# EAGLE design transistor-test (EAGLE 9.2.2)
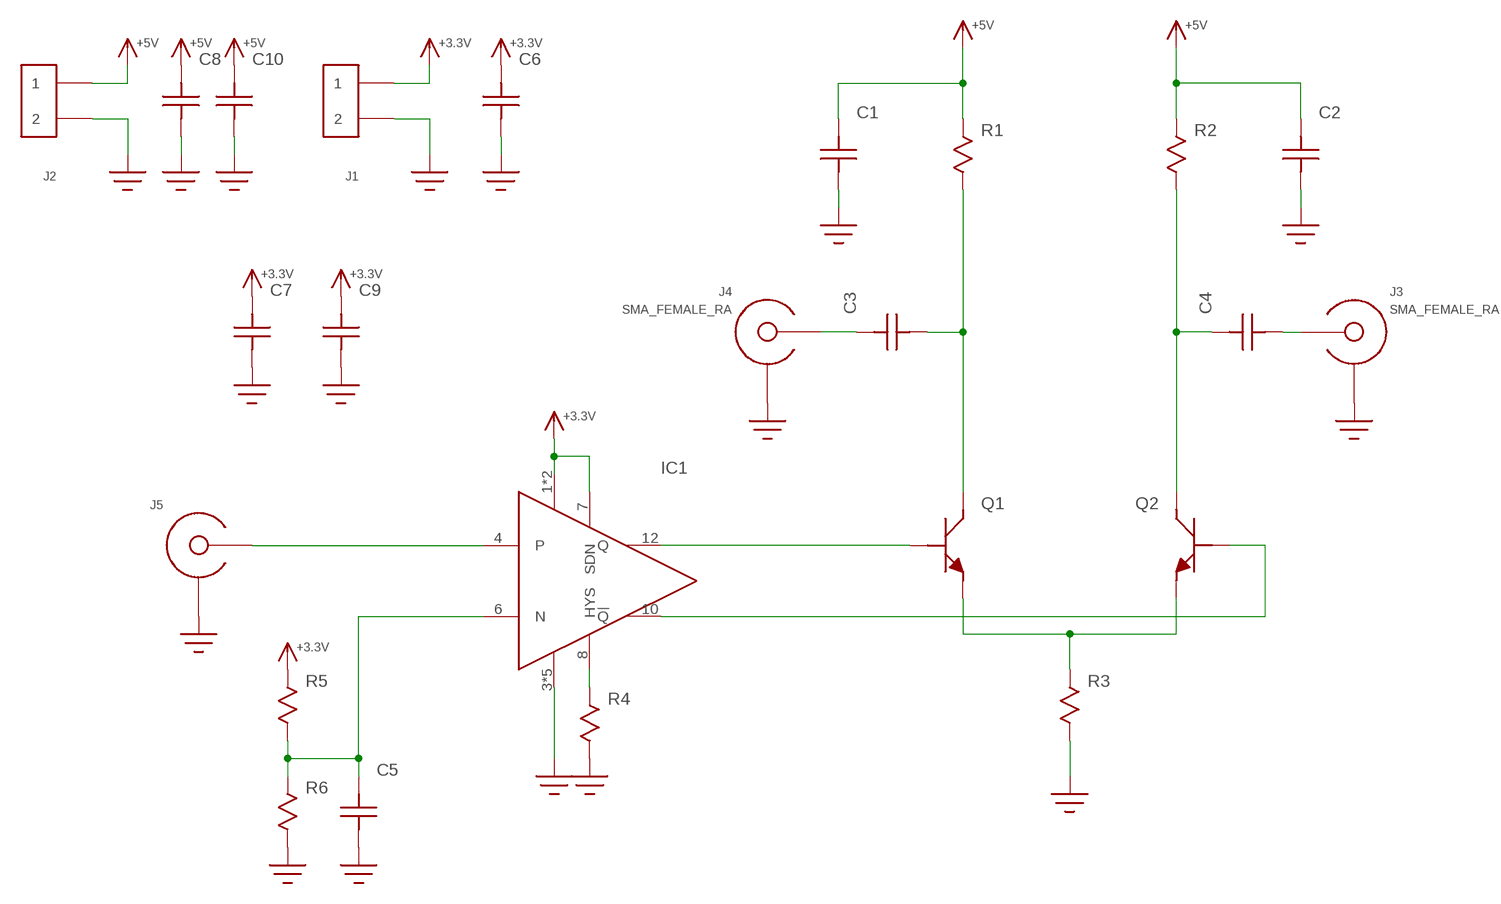
[diagram p0: schematic, sheet 1]

## Parts
C1  C0603  [C0603]
C2  C0603  [C0603]
C3  C0603  [C0603]
C4  C0603  [C0603]
C5  C0603  [C0603]
C6  C1206  [1206]
C7  C0603  [C0603]
C8  C1206  [1206]
C9  C0603  [C0603]
C10  C1206  [1206]
IC1  ADCMP607  [QFN12-3X3]
J1  HEADER_2PIN  [HEADER_2PIN]
J2  HEADER_2PIN  [HEADER_2PIN]
J3  SMA_FEMALE_RA  [SMA_RA_PCB]
J4  SMA_FEMALE_RA  [SMA_RA_PCB]
J5  SMA_END_LAUNCH2L  [SMA_EDGE_LAUNCH_2L]
Q1  MMBTH10  [SOT-23]
Q2  MMBTH10  [SOT-23]
R1  R0603  [R0603]
R2  R0603  [R0603]
R3  R0603  [R0603]
R4  R0603  [R0603]
R5  R0603  [R0603]
R6  R0603  [R0603]

## Nets
+3.3V: C6.P$2 C7.P$2 C9.P$2 IC1.1(VCC) IC1.2(VCC) IC1.7(SDN) J1.1 R5.P$1
+5V: C1.P$2 C2.P$2 C8.P$2 C10.P$2 J2.1 R1.P$1 R2.P$1
GND: C1.P$1 C2.P$1 C5.P$1 C6.P$1 C7.P$1 C8.P$1 C9.P$1 C10.P$1 IC1.3(VEE) IC1.5(VEE) IC1.9(VEE) IC1.11(VEE) IC1.EP(VEE) J1.2 J2.2 J3.SHIELD@1(SHIELD) J3.SHIELD@2(SHIELD) J3.SHIELD@3(SHIELD) J3.SHIELD@4(SHIELD) J4.SHIELD@1(SHIELD) J4.SHIELD@2(SHIELD) J4.SHIELD@3(SHIELD) J4.SHIELD@4(SHIELD) J5.BOTTOM_GND(SHIELD) J5.GND@1(SHIELD) J5.GND@2(SHIELD) J5.GND@3(SHIELD) J5.GND@4(SHIELD) J5.GND@5(SHIELD) J5.GND@6(SHIELD) J5.GND@7(SHIELD) J5.GND@8(SHIELD) J5.GND@11(SHIELD) J5.GND@12(SHIELD) J5.GND@14(SHIELD) J5.GND@15(SHIELD) J5.GND@16(SHIELD) J5.GND@17(SHIELD) J5.GND_PAD1(SHIELD) J5.GND_PAD2(SHIELD) R3.P$2 R4.P$2 R6.P$2
N$1: C3.P$1 Q1.3(C) R1.P$2
N$2: C4.P$2 Q2.3(C) R2.P$2
N$3: Q1.2(E) Q2.2(E) R3.P$1
N$4: IC1.12(Q) Q1.1(B)
N$5: IC1.10(!Q!) Q2.1(B)
N$6: C3.P$2 J4.CENTER
N$7: C4.P$1 J3.CENTER
N$8: C5.P$2 IC1.6(N) R5.P$2 R6.P$1
N$9: IC1.8(HYS) R4.P$1
N$10: IC1.4(P) J5.CENTER@1(CENTER)

## Library data of the parts
C1-C10 = yapo:C
IC1 = yapo:ADCMP607
J1 J2 = yapo:HEADER_2PIN
J3 J4 = yapo:SMA_FEMALE_RA
J5 = yapo:SMA_END_LAUNCH
Q1 Q2 = yapo:MMBTH10
R1-R6 = yapo:R

## Net classes
1 50-ohm: width 0.356 mm, clearance 0.508 mm

## Board
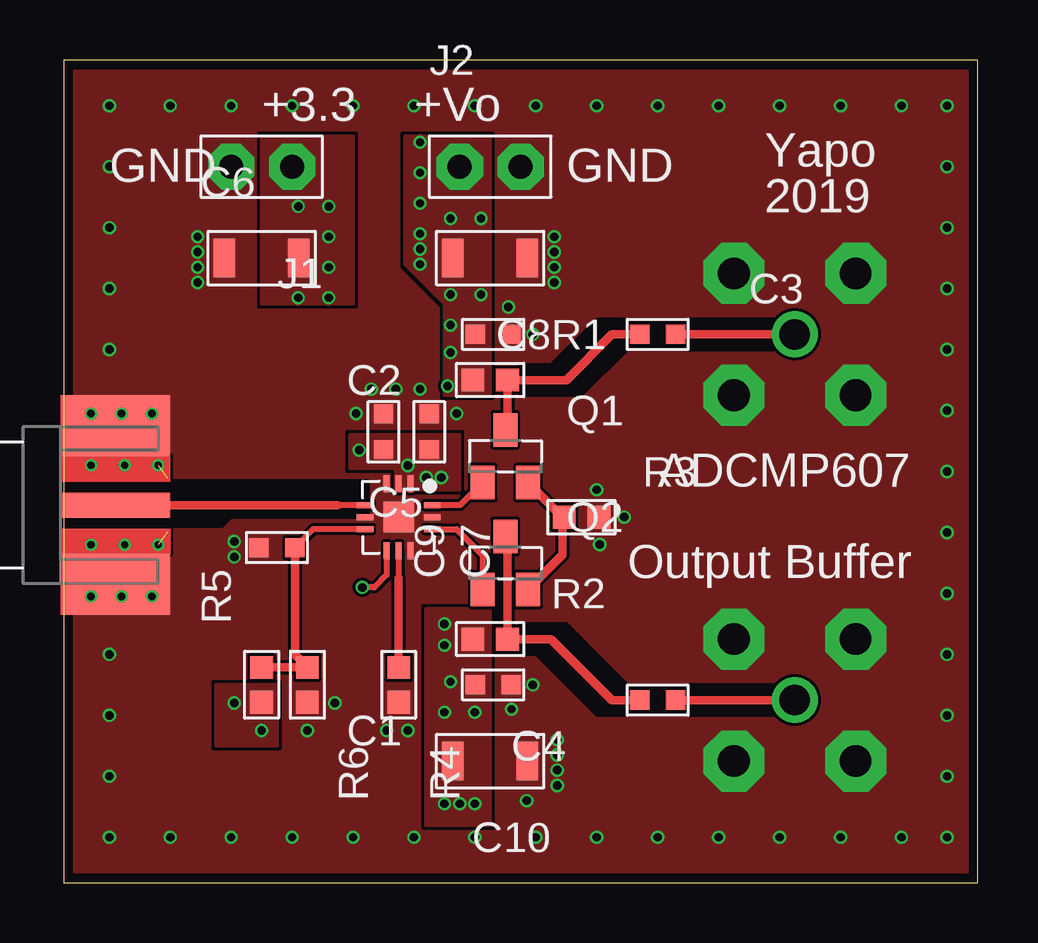
[diagram p1: board, top side]
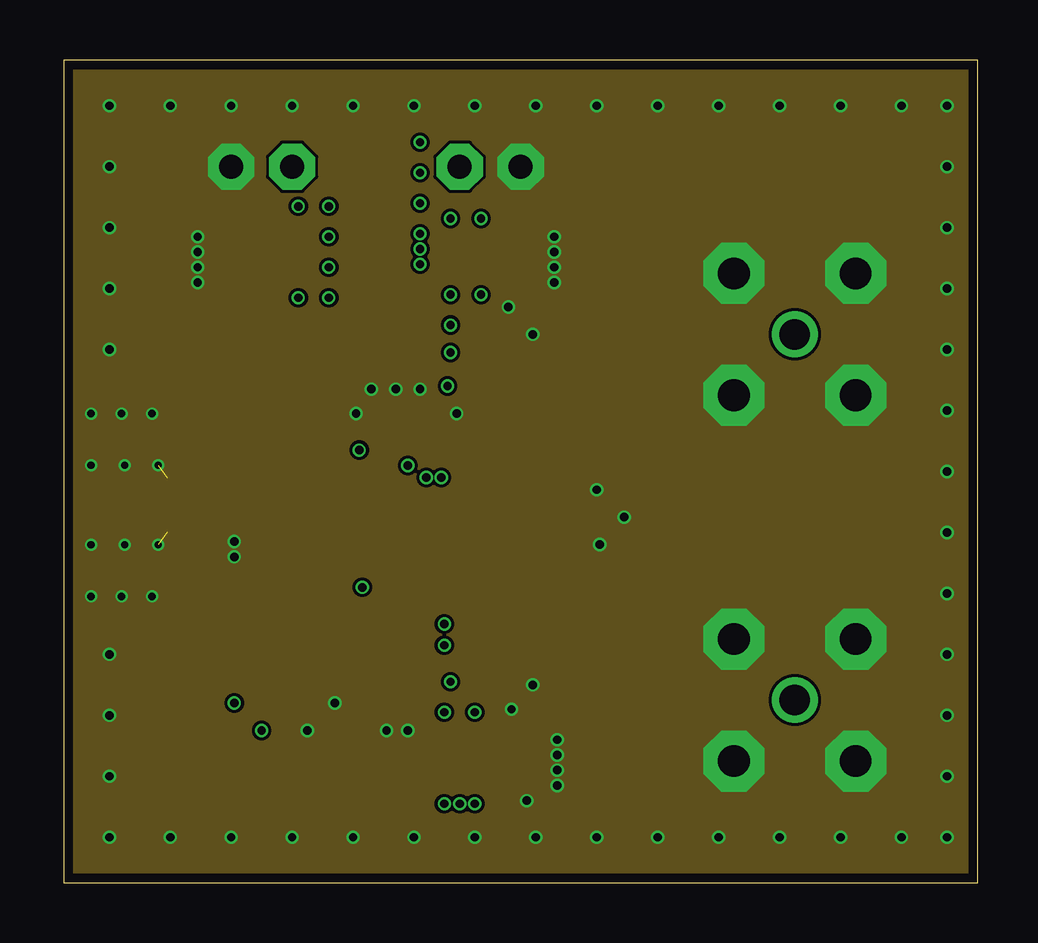
[diagram p2: board, inner layer Route2]
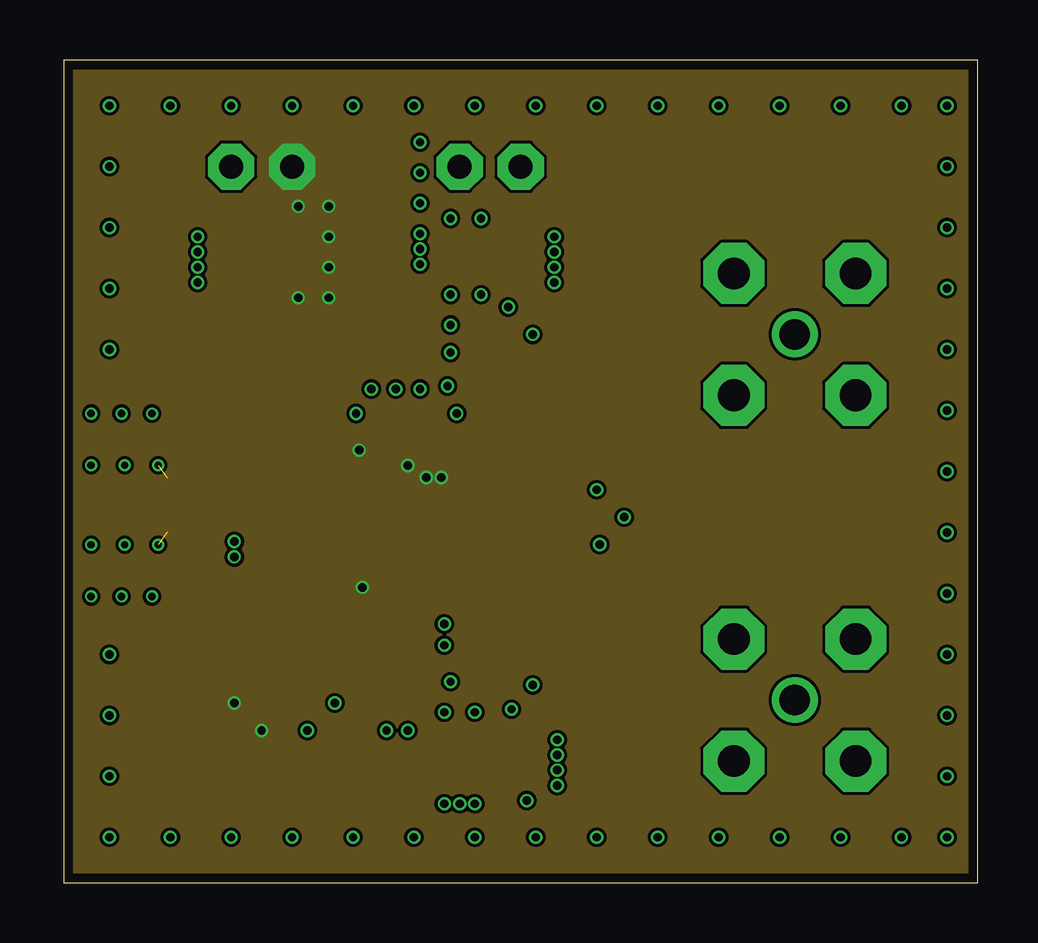
[diagram p3: board, inner layer Route15]
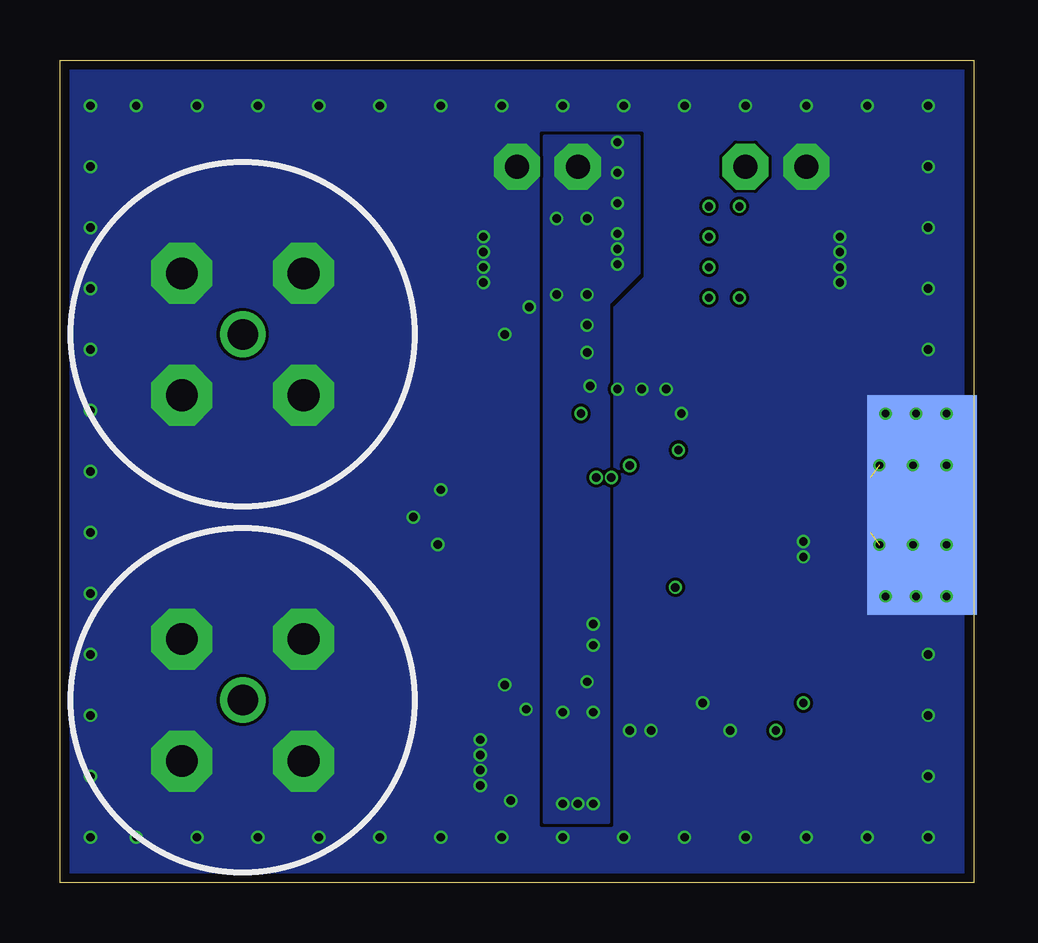
[diagram p4: board, bottom side, seen from below]

Size 38.1 x 34.29 mm. Coordinates in mm from the lower left corner, seen from the top.
Outline: 0,0 38.1,0 38.1,34.29 0,34.29 0,0
Copper layers (1*2*15*16): Top 0.035559375mm / dielectric 0.17018125mm / Route2 0.01778125mm / dielectric 47mil / Route15 0.01778125mm / dielectric 0.17018125mm / Bottom 0.035559375mm
Design rules "oshpark-4layer *": minimum track width 5mil, minimum drill 10mil, track to track 5mil, track to pad 5mil, pad to pad 5mil, via to via 5mil, smd to smd 5mil, copper to edge 15mil, drill to drill 6mil, minimum pad ring 4mil, minimum via ring 4mil, stop-mask expansion 2.5mil, vias tented up to drill 20mil, thermal gap 10mil
tRestrict: area 4.4,14.9 to 12.7,16.8; area 19.1,7 to 24.8,10.8; area 24.8,7 to 29.8,8.3; area 24.8,22.2 to 30.5,23.5; area 19.1,20.3 to 24.8,23.5

### Footprints (pad centres in the part's own frame; a part is rotated, then mirrored left to right if it is on the bottom)
C0603 = smd 0.8 x 0.8: P$1 -0.75,0; P$2 0.75,0
1206 = smd 0.9 x 1.6: P$1 -1.55,0; P$2 1.55,0
QFN12-3X3 = smd 0.7 x 0.25: 1 -1.4,0.5; 2 -1.4,0; 3 -1.4,-0.5; 7 1.4,-0.5; 8 1.4,0; 9 1.4,0.5 | smd 0.25 x 0.7: 4 -0.5,-1.4; 5 0,-1.4; 6 0.5,-1.4; 10 0.5,1.4; 11 0,1.4; 12 -0.5,1.4 | smd 1.27 x 1.27: EP 0,0
HEADER_2PIN = drill 1 pad 1.93 octagon: 1 -1.27,0; 2 1.27,0
SMA_RA_PCB = drill 1.27 pad 1.778: CENTER 0,0 | drill 1.321 pad 2.54 octagon: SHIELD@1 -2.54,-2.54; SHIELD@2 -2.54,2.54; SHIELD@3 2.54,2.54; SHIELD@4 2.54,-2.54
SMA_EDGE_LAUNCH_2L = smd 4.572 x 9.144 bottom: BOTTOM_GND 2.286,0 | smd 4.572 x 1.041: CENTER@1 2.286,0 | drill 0.3: GND@1 1.27,3.81; GND@2 3.81,3.81; GND@3 1.27,1.651; GND@4 4.064,1.651; GND@5 1.27,-1.651; GND@6 4.064,-1.651; GND@7 1.27,-3.81; GND@8 3.81,-3.81; GND@14 2.54,3.81; GND@15 2.54,-3.81; GND@16 2.667,-1.651; GND@17 2.667,1.651 | smd 0.051 x 0.051: GND@11 4.445,1.143; GND@12 4.445,-1.143 | smd 4.572 x 2.54: GND_PAD1 2.286,3.302; GND_PAD2 2.286,-3.302
SOT-23 = smd 1 x 1.4: 1 -0.95,-1.1; 2 0.95,-1.1; 3 0,1.1
R0603 = smd 0.95 x 0.95: P$1 -0.725,0; P$2 0.725,0

### Placement (x,y rotation side)
C1  17.91,8.26 180 top
C2  17.91,22.86 180 top
C3  24.77,22.86 0 top
C4  24.77,7.62 180 top
C5  8.89,13.97 0 top
C6  8.26,26.04 0 top
C7  15.24,18.8 270 top
C8  17.78,26.04 180 top
C9  13.34,18.8 270 top
C10  17.78,5.08 180 top
IC1  13.97,15.24 270 top
J1  8.26,29.84 180 top
J2  17.78,29.84 0 top
J3  30.48,7.62 0 top
J4  30.48,22.86 0 top
J5  -0.13,15.75 0 top
Q1  18.41,17.78 0 top
Q2  18.41,13.34 0 top
R1  17.78,20.95 0 top
R2  17.78,10.16 0 top
R3  21.59,15.24 0 top
R4  13.97,8.26 270 top
R5  8.26,8.26 90 top
R6  10.16,8.26 270 top

### Tracks (layer width: path | path; a pad name or v marks a point on that pad's centre or on a via)
+3.3V  (via drill 0.35)
  Top 0.254: IC1.7 13.47,12.84 12.95,12.32 v12.45,12.32
  other vias: 15.11,16.89 15.75,16.89 12.32,18.03 14.35,17.4 7.11,7.49 8.26,6.35 9.78,28.19 11.05,26.92 11.05,25.65 9.78,24.38 11.05,24.38 11.05,28.19
  pour Route15 (no thermals): 0,0 38.1,0 38.1,34.29 0,34.29
  pour Top (no thermals): 13.84,16.38 13.84,17.27 11.94,17.27 11.94,18.67 16.51,18.67 16.51,16.38
  pour Top (no thermals): 6.99,8.26 8.89,8.26 8.89,5.71 6.35,5.71 6.35,8.26
  pour Top (no thermals): 8.26,31.11 8.26,24.13 12.06,24.13 12.06,31.11
+5V  (via drill 0.35)
  other vias: 16,20.7 16.13,22.1 16.13,23.24 15.88,10.79 15.88,9.91 16.13,8.38 17.14,7.11 16.13,27.69 17.4,27.69 14.86,27.05 14.86,26.42 14.86,25.78 14.86,30.86 14.86,29.59 14.86,28.32 16.13,24.51 17.4,24.51 15.88,7.11 15.88,3.3 17.14,3.3 16.51,3.3
  pour Top (no thermals): 15.88,24.13 17.78,24.13 17.78,20.32 15.88,20.32
  pour Top (no thermals): 15.11,11.43 17.78,11.43 17.78,2.41 15.11,2.41
  pour Top (no thermals): 15.24,31.11 15.24,24.77 15.88,24.13 17.78,24.13 17.78,31.11
  pour Top (no thermals): 15.24,31.11 15.24,24.77 15.88,24.13 17.78,24.13 17.78,31.11
  pour Top (no thermals): 14.22,31.11 14.22,25.78 15.88,24.13 17.78,24.13 17.78,31.11
  pour Bottom (no thermals): 13.97,31.11 13.97,25.4 15.24,24.13 15.24,2.54 17.91,2.54 17.91,31.11
GND  (via drill 0.35)  (2 unrouted)
  other vias: 13.84,20.57 14.86,20.57 23.37,15.24 12.83,20.57 12.19,19.56 16.38,19.56 7.11,14.22 7.11,13.59 11.3,7.49 10.16,6.35 13.46,6.35 14.35,6.35 19.56,8.26 18.67,7.24 18.54,24 19.56,22.86 22.23,16.38 22.35,14.1 5.59,26.92 5.59,26.29 5.59,25.65 5.59,25.02 20.45,26.92 20.45,26.29 20.45,25.65 20.45,25.02 1.91,1.91 4.45,1.91 6.99,1.91 9.53,1.91 12.06,1.91 14.61,1.91 17.14,1.91 19.68,1.91 22.23,1.91 24.77,1.91 1.91,32.38 4.45,32.38 6.99,32.38 9.53,32.38 12.06,32.38 14.61,32.38 17.14,32.38 19.68,32.38 22.23,32.38 24.77,32.38 27.3,32.38 29.84,32.38 32.38,32.38 34.92,32.38 27.3,1.91 29.84,1.91 32.38,1.91 34.92,1.91 36.83,1.91 36.83,4.45 36.83,6.99 36.83,9.53 36.83,12.06 36.83,14.61 36.83,17.14 36.83,19.68 36.83,22.23 36.83,24.77 36.83,27.3 36.83,29.84 36.83,32.38 1.91,4.45 1.91,6.99 1.91,9.53 1.91,22.23 1.91,24.77 1.91,27.3 1.91,29.84 19.3,3.43 20.57,4.7 20.57,5.97 20.57,4.06 20.57,5.33
  pour Top (rank 2, no thermals): 0,0 38.1,0 38.1,34.29 0,34.29
  pour Route2 (no thermals): 0,0 38.1,0 38.1,34.29 0,34.29
  pour Bottom (rank 2, no thermals): 0,0 38.1,0 38.1,34.29 0,34.29
N$1
  Top 0.356: Q1.3 18.5,18.97 R1.P$2 20.95,20.95 22.86,22.86 C3.P$1
N$2
  Top 0.356: Q2.3 18.5,14.35 R2.P$2 20.32,10.16 22.86,7.62 C4.P$2
N$3
  Top 0.356: Q1.2 20.8,15.24 | 20.8,15.24 R3.P$1 | Q2.2 20.8,13.68 20.8,15.24
N$4
  Top 0.254: Q1.1 16.52,15.74 IC1.12
N$5
  Top 0.254: IC1.10 16.38,14.74 17.46,13.65 Q2.1
N$6
  Top 0.356: C3.P$2 J4.CENTER
N$7
  Top 0.356: C4.P$1 J3.CENTER
N$8
  Top 0.254: IC1.6 10.41,14.74 C5.P$2
  Top 0.356: C5.P$2 9.64,9.5 R6.P$1 R5.P$2
N$9
  Top 0.254: IC1.8 13.97,12.7
  Top 0.356: 13.97,12.7 R4.P$1
N$10
  Top 0.254: IC1.4 11.43,15.74
  Top 0.356: 11.43,15.74 J5.CENTER@1

### Text on the board
tPlace: +3.3 | +Vo | Yapo | GND | GND | 2019 | ADCMP607 | Output Buffer